# EAGLE design RumiCarGen3-Sensor4 (EAGLE 9.6.2)
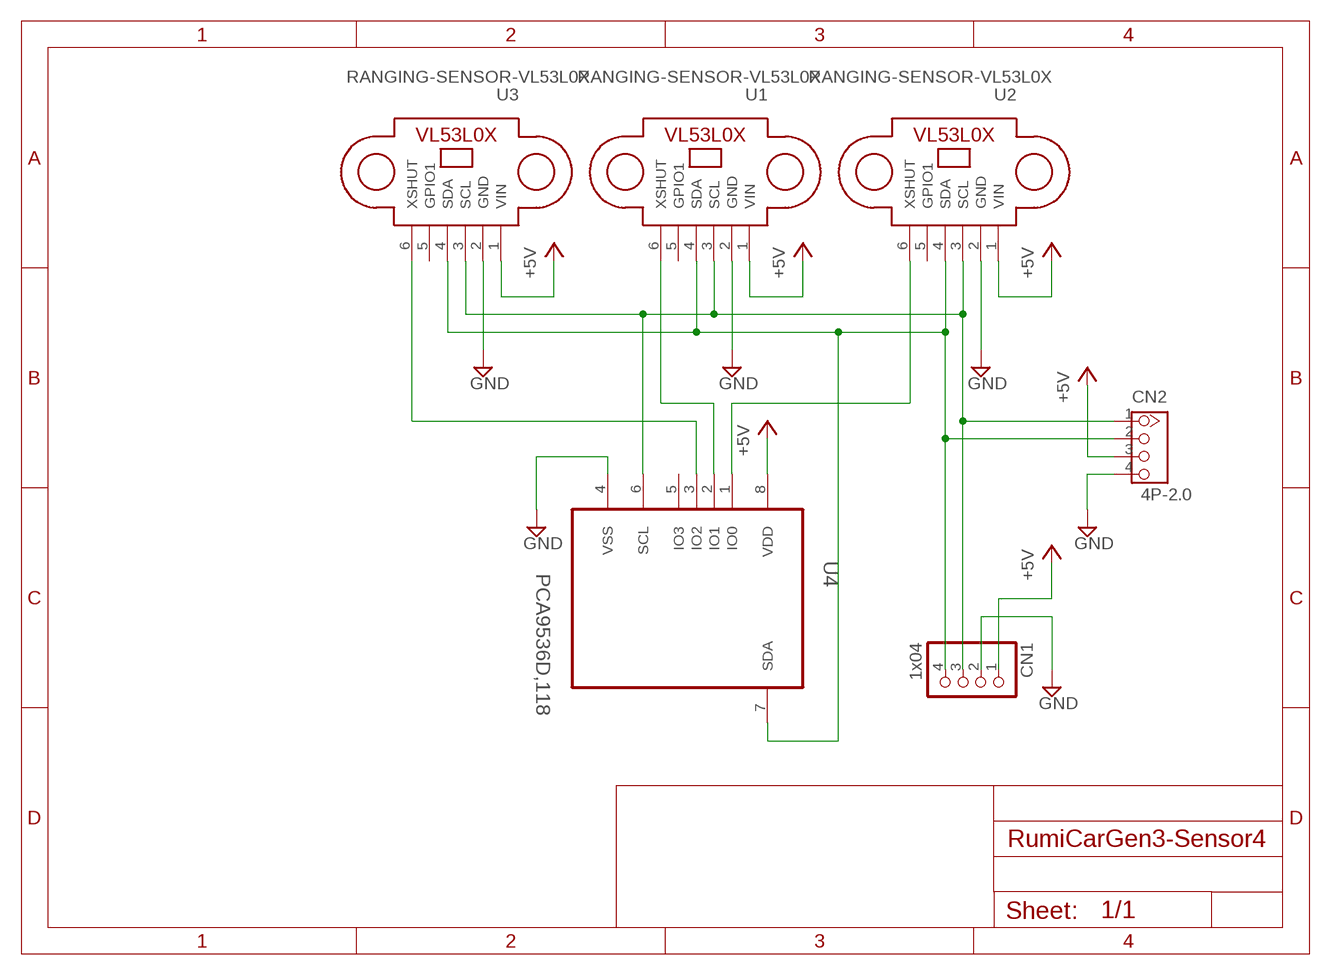
[diagram p0: schematic, sheet 1]

## Parts
CN1  1x04  PINHD-1X4  [1X04]
CN2  4P-2.0  GROVE-CONNECTOR-DIP(4P-2.0)  [HW4-2.0]
U1  RANGING-SENSOR-VL53L0X  [RANGING-SENSOR-VL53L0X]
U2  RANGING-SENSOR-VL53L0X  [RANGING-SENSOR-VL53L0X]
U3  RANGING-SENSOR-VL53L0X  [RANGING-SENSOR-VL53L0X]
U4  PCA9536D,118  [SOIC127P600X175-8N]

## Nets
+5V: CN1.1 CN2.3 U1.1(VIN) U2.1(VIN) U3.1(VIN) U4.8(VDD)
GND: CN1.2 CN2.4 U1.2(GND) U2.2(GND) U3.2(GND) U4.4(VSS)
N$3: U1.6(XSHUT) U4.2(IO1)
N$7: U2.6(XSHUT) U4.1(IO0)
N$20: U3.6(XSHUT) U4.3(IO2)
N$21: CN1.3 CN2.1 U1.3(SCL) U2.3(SCL) U3.3(SCL) U4.6(SCL)
N$22: CN1.4 CN2.2 U1.4(SDA) U2.4(SDA) U3.4(SDA) U4.7(SDA)
Unconnected: U1.5(GPIO1) U2.5(GPIO1) U3.5(GPIO1) U4.5(IO3)

## Library data of the parts
CN1 = pinhead2:PINHD-1X4: PIN HEADER
CN2 = OPL_Connector:GROVE-CONNECTOR-DIP(4P-2.0): 320110033
U1-U3 = diy-modules:RANGING-SENSOR-VL53L0X: Laser Ranging Sensor based on VL53L0X device More information about VL53L0X device can be found here: http://www.st.com/en/imaging-and-photonics-solutions/vl53l0x.html Arduino Library for VL53L0X is available here: https://github.com/pololu/vl53l0x-arduino Click here to find device on ebay.com <http://www.ebay.com/sch/GY+VL53L0X+module> Note: There are many variants. Search for the proper version.
U4 = PCA9536D_118:PCA9536D,118: 4-bit I2C-bus and SMBus I/O port Check prices <https://pricing.snapeda.com/parts/PCA9536D%2C118/NXP%20USA/view-part?ref=eda>; AVAILABILITY: Good; DESCRIPTION: I/O Expander 4 I²C, SMBus 400kHz 8-SO; MF: NXP USA; MP: PCA9536D,118; PACKAGE: SO-8 NXP Semiconductors; PRICE: None; PURCHASE-URL: https://pricing.snapeda.com/search/part/PCA9536D,118/?ref=eda

## Board
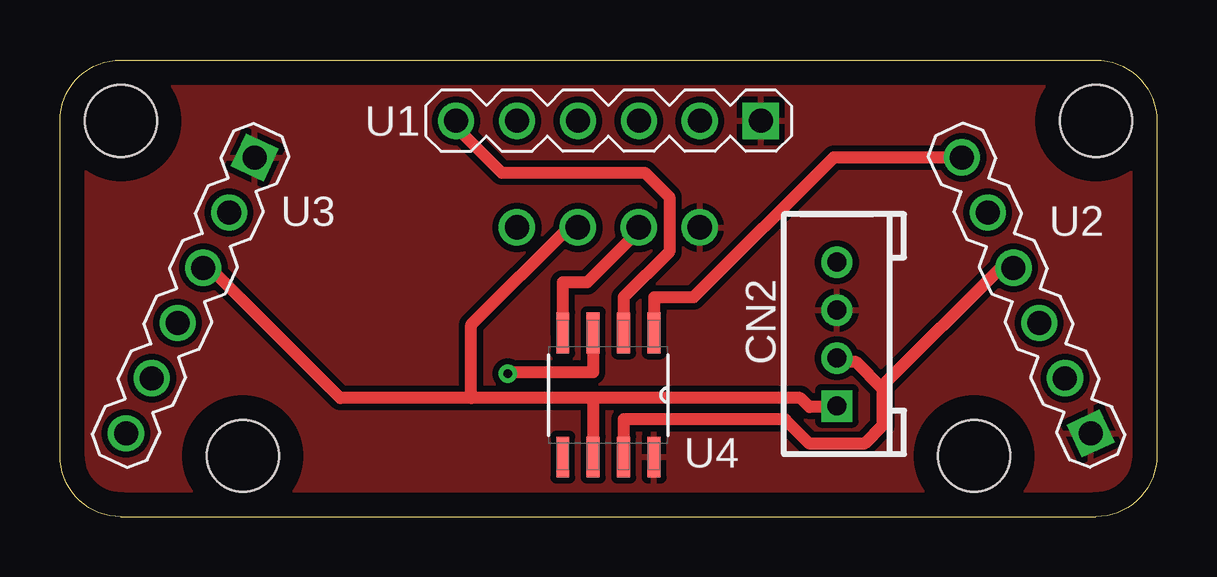
[diagram p1: board, top side]
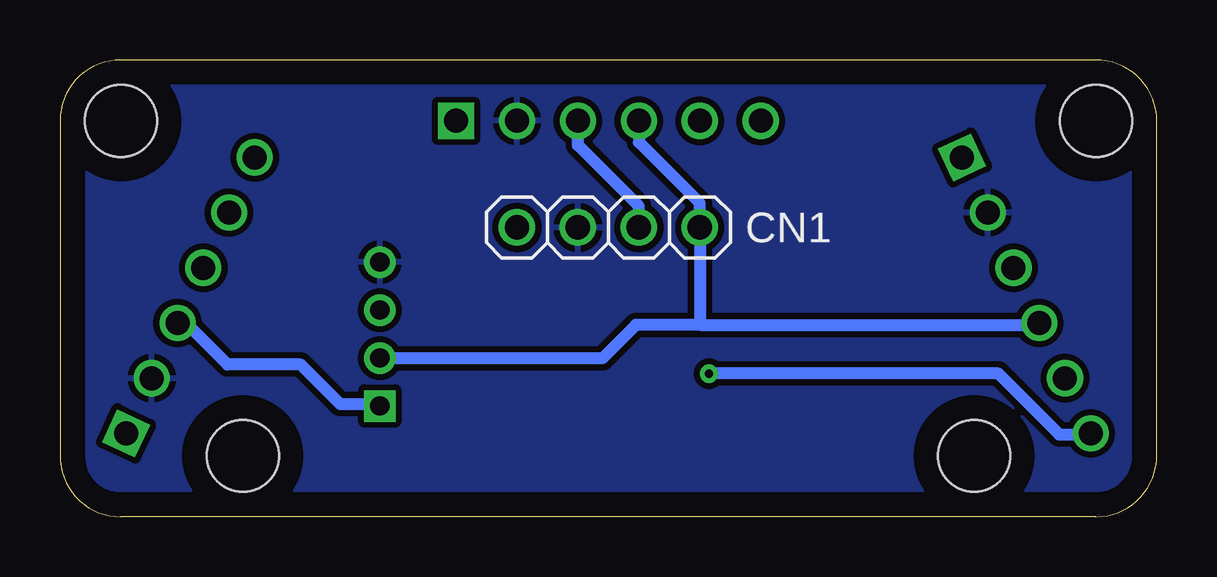
[diagram p2: board, bottom side, seen from below]

Size 45.72 x 19.05 mm. Coordinates in mm from the lower left corner, seen from the top.
Outline: 0,2.54 0,16.51 arc-90 2.54,19.05 43.18,19.05 arc-90 45.72,16.51 45.72,2.54 arc-90 43.18,0 2.54,0 arc-90 0,2.54
Copper layers (1*16): Top 0.035mm / dielectric 1.5mm / Bottom 0.035mm
Design rules "default *": minimum track width 20mil, minimum drill 0.35mm, track to track 10mil, track to pad 10mil, pad to pad 10mil, via to via 10mil, smd to smd 6mil, copper to edge 40mil, drill to drill 6mil, minimum pad ring 10mil, minimum via ring 8mil, stop-mask expansion 4mil, vias tented up to drill 0mil, thermal gap 10mil
Holes 3 mm at 2.54,16.51 7.62,2.54 38.1,2.54 43.18,16.51
tRestrict: area 0.5,14.5 to 4.6,18.5; area 5.6,0.5 to 9.7,4.6; area 36.1,0.5 to 40.1,4.6; area 41.1,14.5 to 45.2,18.5
bRestrict: area 41.1,14.5 to 45.2,18.5; area 36.1,0.5 to 40.1,4.6; area 0.5,14.5 to 4.6,18.5; area 5.6,0.5 to 9.7,4.6

### Footprints (pad centres in the part's own frame; a part is rotated, then mirrored left to right if it is on the bottom)
1X04 = drill 1.016: 1 -3.81,0; 2 -1.27,0; 3 1.27,0; 4 3.81,0
HW4-2.0 = drill 0.8 pad 1.27 square: 1 -3,0 | drill 0.8 pad 1.27: 2 -1,0; 3 1,0; 4 3,0
RANGING-SENSOR-VL53L0X = drill 1 square: 1 -3.81,6.35 | drill 1: 2 -3.81,3.81; 3 -3.81,1.27; 4 -3.81,-1.27; 5 -3.81,-3.81; 6 -3.81,-6.35
SOIC127P600X175-8N = smd 1.702 x 0.533: 1 -2.591,1.905; 2 -2.591,0.635; 3 -2.591,-0.635; 4 -2.591,-1.905; 5 2.591,-1.905; 6 2.591,-0.635; 7 2.591,0.635; 8 2.591,1.905

### Placement (x,y rotation side)
CN1  22.86,12.06 0 bottom
CN2  32.38,7.62 90 top
U1  22.86,12.7 270 top
U2  36.83,7.62 205 top
U3  8.89,7.62 335 top
U4  22.86,5.08 270 top

### Tracks (layer width: path | path; a pad name or v marks a point on that pad's centre or on a via)
+5V
  pour Top: 0.64,18.41 0.64,0.64 36.2,0.64 45.09,0.64 45.09,18.41
GND
  Top 0.508: U4.4 20.95,9.78 21.97,9.78 24.13,11.94 CN1.2
  pour Bottom: 0.64,18.41 0.64,0.64 29.21,0.64 36.2,0.64 45.09,0.64 45.09,18.41
N$3
  Top 0.508: U4.2 23.5,9.14 25.4,11.05 25.4,13.34 24.38,14.35 18.41,14.35 16.38,16.38 U1.6
N$7
  Top 0.508: U4.1 24.77,9.14 26.42,9.14 32.26,14.99 U2.6
N$20  (via drill 0.35)
  Top 0.508: U4.3 22.23,6.02 18.72,6.02 v18.67,5.97
  Bottom 0.508: v18.67,5.97 6.6,5.97 4.06,3.43 2.8,3.43 U3.6
N$21
  Top 0.508: 22.23,4.95 U4.6 | 22.23,4.95 30.86,4.95 31.24,4.57 32.38,4.57 CN2.1 | U3.3 6.26,10.38 11.68,4.95 17.14,4.95 | 22.23,4.95 17.14,4.95 | CN1.3 21.21,12.06 17.14,8 17.14,4.95
  Bottom 0.508: U1.3 24.13,15.49 21.59,12.95 CN1.3 | U2.3 40.46,8.08 38.73,6.35 35.69,6.35 34.04,4.7 32.46,4.7 CN2.1
N$22
  Top 0.508: U4.7 23.5,4.06 30.23,4.06 31.24,3.05 33.53,3.05 34.29,3.81 34.29,5.33 | 34.29,5.33 34.29,5.46 39.21,10.38 U2.4 | 34.29,5.33 33.15,6.48 32.38,6.48 CN2.2
  Bottom 0.508: 19.05,8 CN1.4 19.05,13.08 21.59,15.62 U1.4 | 19.05,8 21.72,8 23.11,6.6 32.38,6.6 CN2.2 | U3.4 4.98,8 19.05,8